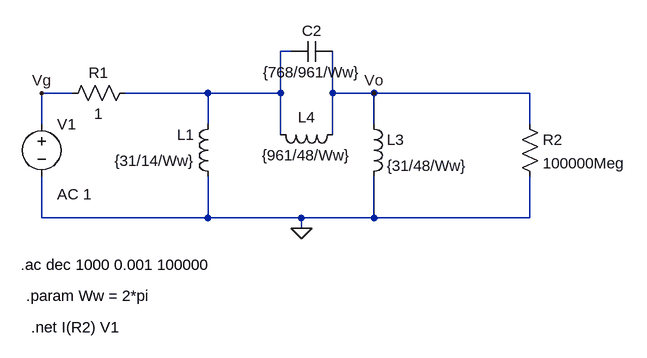
[diagram p0: schematic Ej1.asc]
Ej1.asc, the LTspice schematic file:
Version 4
SHEET 1 880 680
WIRE 240 32 224 32
WIRE -96 96 -144 96
WIRE 112 96 -16 96
WIRE 224 96 224 32
WIRE 224 96 112 96
WIRE 304 96 304 32
WIRE 368 96 304 96
WIRE 608 96 368 96
WIRE -144 144 -144 96
WIRE 112 144 112 96
WIRE 368 144 368 96
WIRE 608 144 608 96
WIRE 224 160 224 96
WIRE 304 160 304 96
WIRE -144 288 -144 224
WIRE 112 288 112 224
WIRE 112 288 -144 288
WIRE 256 288 112 288
WIRE 368 288 368 224
WIRE 368 288 256 288
WIRE 608 288 608 224
WIRE 608 288 368 288
WIRE 256 304 256 288
FLAG 256 304 0
FLAG 368 96 Vo
FLAG -144 96 Vg
SYMBOL ind 128 240 R180
WINDOW 0 36 80 Left 2
WINDOW 3 36 40 Left 2
SYMATTR InstName L1
SYMATTR Value {31/14/Ww}
SYMBOL ind 352 128 R0
SYMATTR InstName L3
SYMATTR Value {31/48/Ww}
SYMATTR SpiceLine Rser=0
SYMBOL voltage -144 128 R0
WINDOW 123 24 124 Left 2
WINDOW 39 0 0 Left 0
SYMATTR InstName V1
SYMATTR Value ""
SYMATTR Value2 AC 1
SYMBOL res 0 80 R90
WINDOW 0 0 56 VBottom 2
WINDOW 3 32 56 VTop 2
SYMATTR InstName R1
SYMATTR Value 1
SYMBOL ind 320 144 R90
WINDOW 0 5 56 VBottom 2
WINDOW 3 32 56 VTop 2
SYMATTR InstName L4
SYMATTR Value {961/48/Ww}
SYMATTR SpiceLine Rser=0
SYMBOL cap 304 16 R90
WINDOW 0 0 32 VBottom 2
WINDOW 3 32 32 VTop 2
SYMATTR InstName C2
SYMATTR Value {768/961/Ww}
SYMBOL res 592 128 R0
SYMATTR InstName R2
SYMATTR Value 100000Meg
TEXT -176 360 Left 2 !.ac dec 1000 0.001 100000
TEXT -168 408 Left 2 !.param Ww = 2*pi
TEXT -160 456 Left 2 !.net I(R2) V1

The netlist it stands for:
* Ej1.asc
L1 0 N001 {31/14/Ww}
L3 Vo 0 {31/48/Ww} Rser=0
V1 Vg 0 AC 1
R1 N001 Vg 1
L4 Vo N001 {961/48/Ww} Rser=0
C2 Vo N001 {768/961/Ww}
R2 Vo 0 100000Meg
.ac dec 1000 0.001 100000
.param Ww = 2*pi
.net I(R2) V1
.backanno
.end